# EAGLE design 8x8-LED-Matrix-Rev4 (EAGLE 5.11)
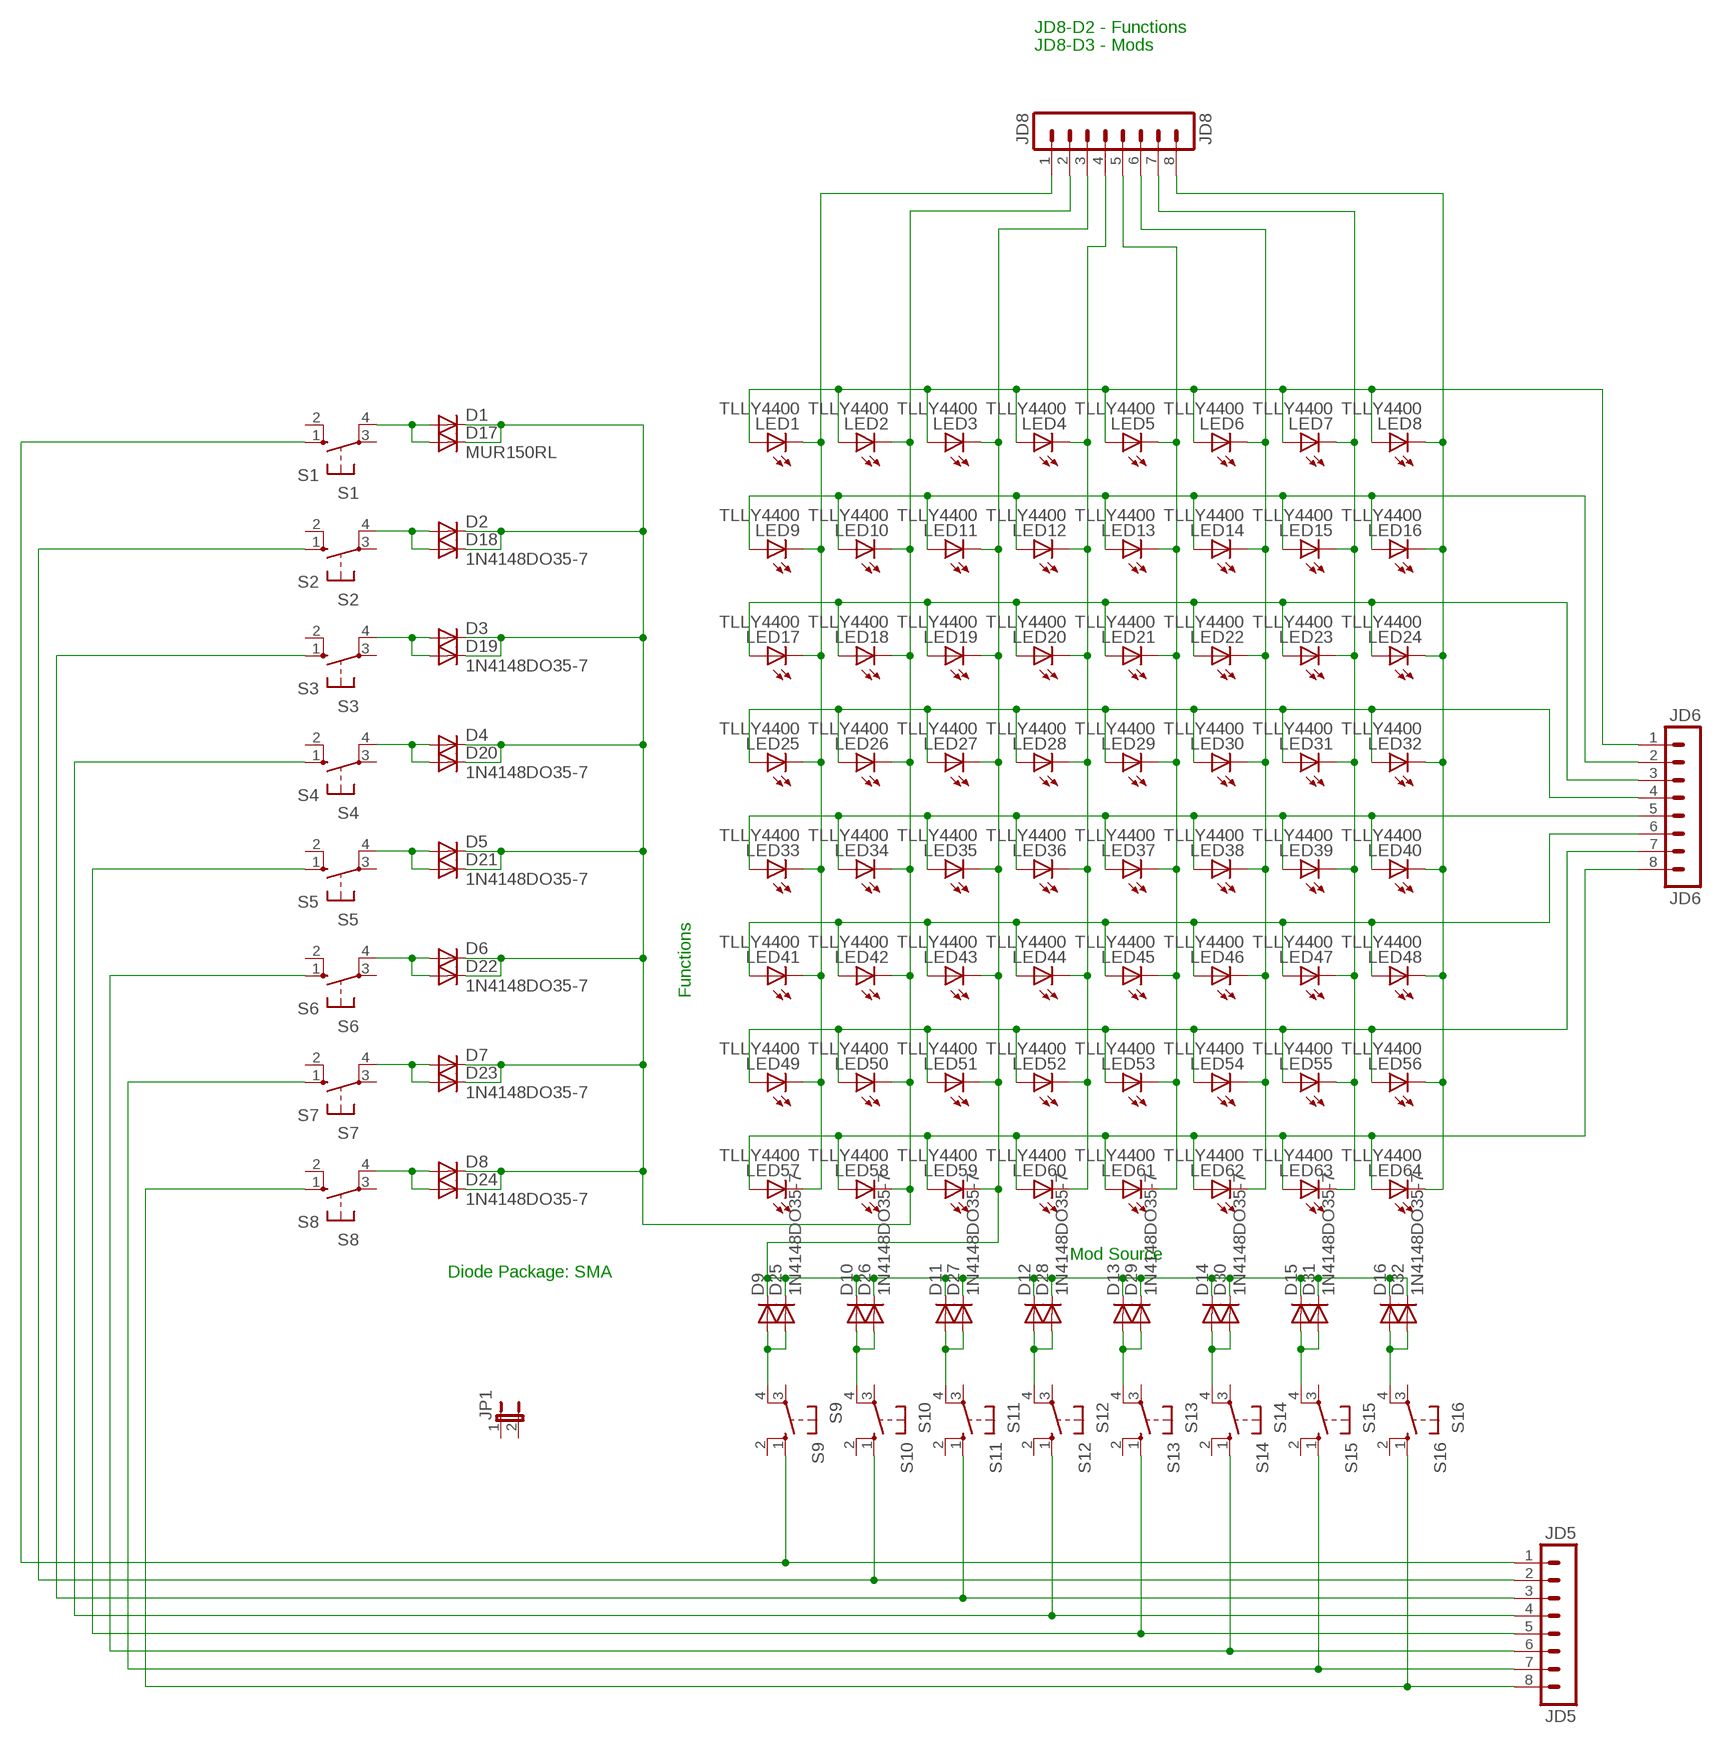
[diagram p0: schematic, sheet 1]

## Parts
D1  DIODE-DO214AC  [DO214AC]
D2  DIODE-DO214AC  [DO214AC]
D3  DIODE-DO214AC  [DO214AC]
D4  DIODE-DO214AC  [DO214AC]
D5  DIODE-DO214AC  [DO214AC]
D6  DIODE-DO214AC  [DO214AC]
D7  DIODE-DO214AC  [DO214AC]
D8  DIODE-DO214AC  [DO214AC]
D9  DIODE-DO214AC  [DO214AC]
D10  DIODE-DO214AC  [DO214AC]
D11  DIODE-DO214AC  [DO214AC]
D12  DIODE-DO214AC  [DO214AC]
D13  DIODE-DO214AC  [DO214AC]
D14  DIODE-DO214AC  [DO214AC]
D15  DIODE-DO214AC  [DO214AC]
D16  DIODE-DO214AC  [DO214AC]
D17  MUR150RL  DIODE-D-7.5  [D-7.5]
D18  1N4148DO35-7  DIODE-D-7.5  [D-7.5]
D19  1N4148DO35-7  DIODE-D-7.5  [D-7.5]
D20  1N4148DO35-7  DIODE-D-7.5  [D-7.5]
D21  1N4148DO35-7  DIODE-D-7.5  [D-7.5]
D22  1N4148DO35-7  DIODE-D-7.5  [D-7.5]
D23  1N4148DO35-7  DIODE-D-7.5  [D-7.5]
D24  1N4148DO35-7  DIODE-D-7.5  [D-7.5]
D25  1N4148DO35-7  DIODE-D-7.5  [D-7.5]
D26  1N4148DO35-7  DIODE-D-7.5  [D-7.5]
D27  1N4148DO35-7  DIODE-D-7.5  [D-7.5]
D28  1N4148DO35-7  DIODE-D-7.5  [D-7.5]
D29  1N4148DO35-7  DIODE-D-7.5  [D-7.5]
D30  1N4148DO35-7  DIODE-D-7.5  [D-7.5]
D31  1N4148DO35-7  DIODE-D-7.5  [D-7.5]
D32  1N4148DO35-7  DIODE-D-7.5  [D-7.5]
JD5  JD5  MA08-1  [MA08-1]
JD6  JD6  MA08-1  [MA08-1]
JD8  JD8  MA08-1  [MA08-1]
JP1  JP1E  [JP1]
LED1  TLLY4400  [LED3MM]
LED2  TLLY4400  [LED3MM]
LED3  TLLY4400  [LED3MM]
LED4  TLLY4400  [LED3MM]
LED5  TLLY4400  [LED3MM]
LED6  TLLY4400  [LED3MM]
LED7  TLLY4400  [LED3MM]
LED8  TLLY4400  [LED3MM]
LED9  TLLY4400  [LED3MM]
LED10  TLLY4400  [LED3MM]
LED11  TLLY4400  [LED3MM]
LED12  TLLY4400  [LED3MM]
LED13  TLLY4400  [LED3MM]
LED14  TLLY4400  [LED3MM]
LED15  TLLY4400  [LED3MM]
LED16  TLLY4400  [LED3MM]
LED17  TLLY4400  [LED3MM]
LED18  TLLY4400  [LED3MM]
LED19  TLLY4400  [LED3MM]
LED20  TLLY4400  [LED3MM]
LED21  TLLY4400  [LED3MM]
LED22  TLLY4400  [LED3MM]
LED23  TLLY4400  [LED3MM]
LED24  TLLY4400  [LED3MM]
LED25  TLLY4400  [LED3MM]
LED26  TLLY4400  [LED3MM]
LED27  TLLY4400  [LED3MM]
LED28  TLLY4400  [LED3MM]
LED29  TLLY4400  [LED3MM]
LED30  TLLY4400  [LED3MM]
LED31  TLLY4400  [LED3MM]
LED32  TLLY4400  [LED3MM]
LED33  TLLY4400  [LED3MM]
LED34  TLLY4400  [LED3MM]
LED35  TLLY4400  [LED3MM]
LED36  TLLY4400  [LED3MM]
LED37  TLLY4400  [LED3MM]
LED38  TLLY4400  [LED3MM]
LED39  TLLY4400  [LED3MM]
LED40  TLLY4400  [LED3MM]
LED41  TLLY4400  [LED3MM]
LED42  TLLY4400  [LED3MM]
LED43  TLLY4400  [LED3MM]
LED44  TLLY4400  [LED3MM]
LED45  TLLY4400  [LED3MM]
LED46  TLLY4400  [LED3MM]
LED47  TLLY4400  [LED3MM]
LED48  TLLY4400  [LED3MM]
LED49  TLLY4400  [LED3MM]
LED50  TLLY4400  [LED3MM]
LED51  TLLY4400  [LED3MM]
LED52  TLLY4400  [LED3MM]
LED53  TLLY4400  [LED3MM]
LED54  TLLY4400  [LED3MM]
LED55  TLLY4400  [LED3MM]
LED56  TLLY4400  [LED3MM]
LED57  TLLY4400  [LED3MM]
LED58  TLLY4400  [LED3MM]
LED59  TLLY4400  [LED3MM]
LED60  TLLY4400  [LED3MM]
LED61  TLLY4400  [LED3MM]
LED62  TLLY4400  [LED3MM]
LED63  TLLY4400  [LED3MM]
LED64  TLLY4400  [LED3MM]
S1  S1  10-XX  [B3F-10XX]
S2  S2  10-XX  [B3F-10XX]
S3  S3  10-XX  [B3F-10XX]
S4  S4  10-XX  [B3F-10XX]
S5  S5  10-XX  [B3F-10XX]
S6  S6  10-XX  [B3F-10XX]
S7  S7  10-XX  [B3F-10XX]
S8  S8  10-XX  [B3F-10XX]
S9  S9  10-XX  [B3F-10XX]
S10  S10  10-XX  [B3F-10XX]
S11  S11  10-XX  [B3F-10XX]
S12  S12  10-XX  [B3F-10XX]
S13  S13  10-XX  [B3F-10XX]
S14  S14  10-XX  [B3F-10XX]
S15  S15  10-XX  [B3F-10XX]
S16  S16  10-XX  [B3F-10XX]

## Nets
N$1: JD6.1 LED1.A LED2.A LED3.A LED4.A LED5.A LED6.A LED7.A LED8.A
N$2: JD6.2 LED9.A LED10.A LED11.A LED12.A LED13.A LED14.A LED15.A LED16.A
N$3: JD6.3 LED17.A LED18.A LED19.A LED20.A LED21.A LED22.A LED23.A LED24.A
N$4: JD6.4 LED25.A LED26.A LED27.A LED28.A LED29.A LED30.A LED31.A LED32.A
N$5: JD6.5 LED33.A LED34.A LED35.A LED36.A LED37.A LED38.A LED39.A LED40.A
N$6: JD6.6 LED41.A LED42.A LED43.A LED44.A LED45.A LED46.A LED47.A LED48.A
N$7: D1.A D17.A S1.4(P1)
N$8: JD6.8 LED57.A LED58.A LED59.A LED60.A LED61.A LED62.A LED63.A LED64.A
N$9: JD8.1 LED1.K(C) LED9.K(C) LED17.K(C) LED25.K(C) LED33.K(C) LED41.K(C) LED49.K(C) LED57.K(C)
N$10: D1.C D2.C D3.C D4.C D5.C D6.C D7.C D8.C D17.C D18.C D19.C D20.C D21.C D22.C D23.C D24.C JD8.2 LED2.K(C) LED10.K(C) LED18.K(C) LED26.K(C) LED34.K(C) LED42.K(C) LED50.K(C) LED58.K(C)
N$11: D2.A D18.A S2.4(P1)
N$12: JD8.4 LED4.K(C) LED12.K(C) LED20.K(C) LED28.K(C) LED36.K(C) LED44.K(C) LED52.K(C) LED60.K(C)
N$13: JD8.5 LED5.K(C) LED13.K(C) LED21.K(C) LED29.K(C) LED37.K(C) LED45.K(C) LED53.K(C) LED61.K(C)
N$14: JD8.6 LED6.K(C) LED14.K(C) LED22.K(C) LED30.K(C) LED38.K(C) LED46.K(C) LED54.K(C) LED62.K(C)
N$15: JD8.7 LED7.K(C) LED15.K(C) LED23.K(C) LED31.K(C) LED39.K(C) LED47.K(C) LED55.K(C) LED63.K(C)
N$16: JD8.8 LED8.K(C) LED16.K(C) LED24.K(C) LED32.K(C) LED40.K(C) LED48.K(C) LED56.K(C) LED64.K(C)
N$17: JD6.7 LED49.A LED50.A LED51.A LED52.A LED53.A LED54.A LED55.A LED56.A
N$18: JD5.1 S1.1(S) S9.1(S)
N$19: JD5.2 S2.1(S) S10.1(S)
N$20: JD5.4 S4.1(S) S12.1(S)
N$21: JD5.5 S5.1(S) S13.1(S)
N$22: JD5.6 S6.1(S) S14.1(S)
N$23: JD5.7 S7.1(S) S15.1(S)
N$24: JD5.8 S8.1(S) S16.1(S)
N$25: JD5.3 S3.1(S) S11.1(S)
N$26: D3.A D19.A S3.4(P1)
N$27: D4.A D20.A S4.4(P1)
N$28: D5.A D21.A S5.4(P1)
N$29: D6.A D22.A S6.4(P1)
N$30: D7.A D23.A S7.4(P1)
N$31: D9.C D10.C D11.C D12.C D13.C D14.C D15.C D16.C D25.C D26.C D27.C D28.C D29.C D30.C D31.C D32.C JD8.3 LED3.K(C) LED11.K(C) LED19.K(C) LED27.K(C) LED35.K(C) LED43.K(C) LED51.K(C) LED59.K(C)
N$32: D9.A D25.A S9.4(P1)
N$33: D10.A D26.A S10.4(P1)
N$34: D8.A D24.A S8.4(P1)
N$35: D11.A D27.A S11.4(P1)
N$36: D12.A D28.A S12.4(P1)
N$37: D13.A D29.A S13.4(P1)
N$38: D14.A D30.A S14.4(P1)
N$39: D15.A D31.A S15.4(P1)
N$40: D16.A D32.A S16.4(P1)
Unconnected: JP1.1 JP1.2 S1.2(S1) S1.3(P) S2.2(S1) S2.3(P) S3.2(S1) S3.3(P) S4.2(S1) S4.3(P) S5.2(S1) S5.3(P) S6.2(S1) S6.3(P) S7.2(S1) S7.3(P) S8.2(S1) S8.3(P) S9.2(S1) S9.3(P) S10.2(S1) S10.3(P) S11.2(S1) S11.3(P) S12.2(S1) S12.3(P) S13.2(S1) S13.3(P) S14.2(S1) S14.3(P) S15.2(S1) S15.3(P) S16.2(S1) S16.3(P)

## Notes on the sheet
- JD8-D2 - Functions
- JD8-D3 - Mods
- Functions
- Mod Source
- Diode Package: SMA

## Library data of the parts
D1-D16 = diode:DIODE-: DIODE
D17-D32 = diodes:DIODE-: DIODE
JD5 JD6 JD8 = con-lstb:MA08-1: PIN HEADER; OC_FARNELL: unknown; OC_NEWARK: unknown
JP1 = jumper:JP1E: JUMPER
LED1-LED64 = led:TLLY4400: Low Current (2mA) LED 3 mm Tinted Diffused Package color YELLOW Source: Data sheet <http://www.farnell.com/datasheets/391098.pdf>; MF: VISHAY SEMICONDUCTOR; OC_FARNELL: 1612439
S1-S16 = switch-omron:10-XX: OMRON SWITCH; MPN: B3F-1000; OC_FARNELL: 176432; OC_NEWARK: 36M3542

## Board
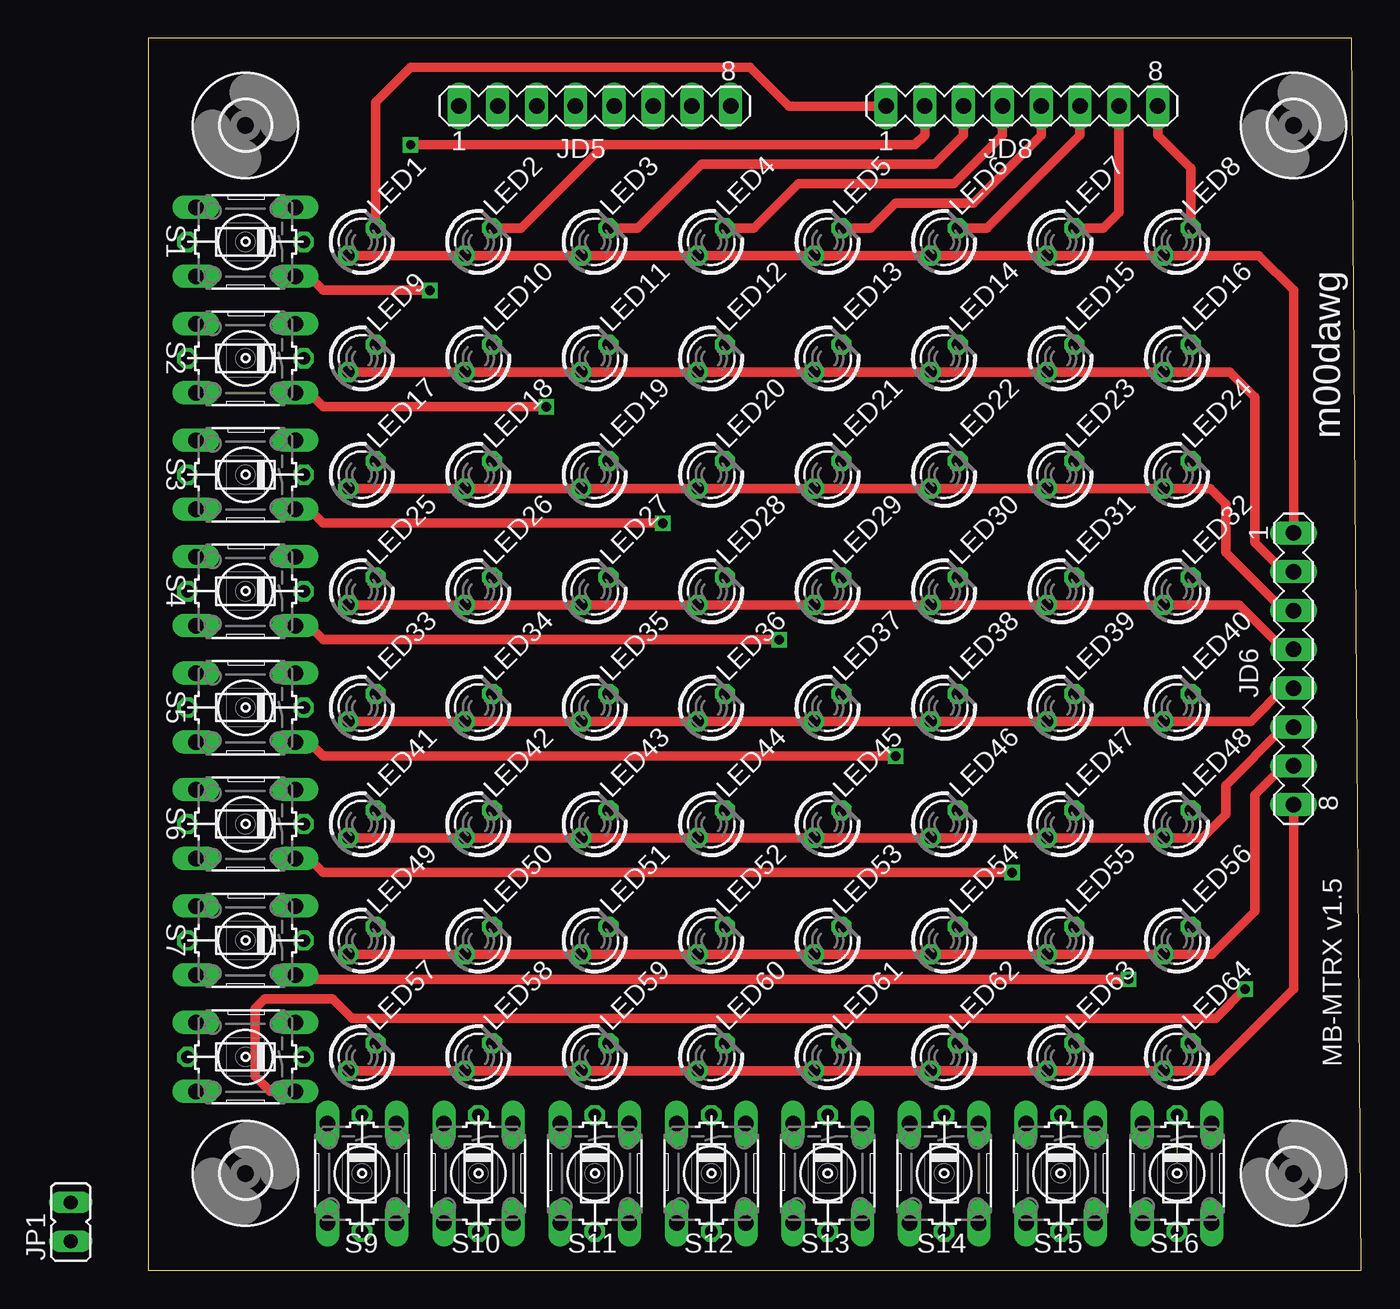
[diagram p1: board, top side]
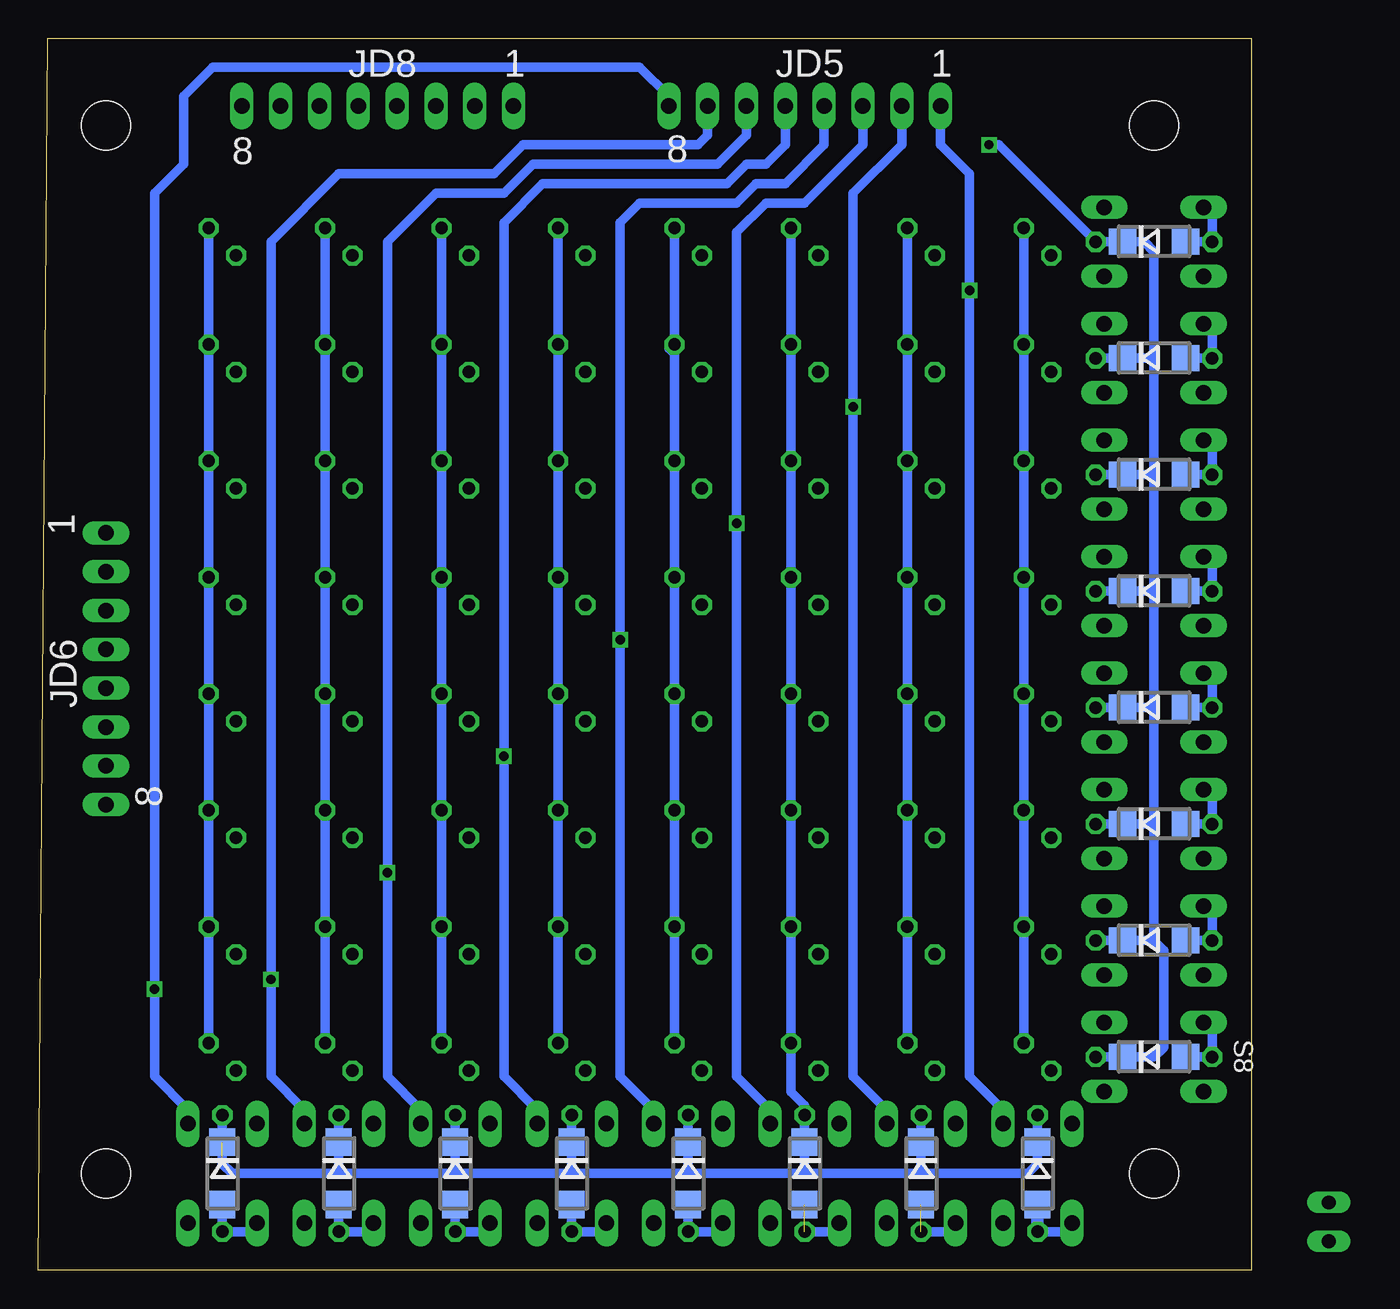
[diagram p2: board, bottom side, seen from below]

Size 79.36 x 80.64 mm. Coordinates in mm from the lower left corner, seen from the top.
Outline: 0,0 79.36,0 78.73,80.64 0,80.64 0,0
Copper layers (1*16): Top 0.035mm / dielectric 1.5mm / Bottom 0.035mm
Design rules "batchpcb": minimum track width 8mil, minimum drill 20mil, track to track 8mil, track to pad 8mil, pad to pad 8mil, via to via 8mil, smd to smd 8mil, copper to edge 40mil, drill to drill 8mil, minimum pad ring 10mil, minimum via ring 8mil, stop-mask expansion 4mil, vias tented up to drill 0mil, thermal gap 10mil

### Footprints (pad centres in the part's own frame; a part is rotated, then mirrored left to right if it is on the bottom)
DO214AC = smd 1.8 x 1.7: A 2.05,0; C -2.05,0
D-7.5 = drill 0.813 octagon: A 3.81,0; C -3.81,0
MA08-1 = drill 1.016 long: 1 -8.89,0; 2 -6.35,0; 3 -3.81,0; 4 -1.27,0; 5 1.27,0; 6 3.81,0; 7 6.35,0; 8 8.89,0
JP1 = drill 0.914 long: 1 0,-1.27; 2 0,1.27
LED3MM = drill 0.813 octagon: A -1.27,0; K 1.27,0
B3F-10XX = drill 1.016 long: 1 -3.251,2.261; 2 3.251,2.261; 3 -3.251,-2.261; 4 3.251,-2.261
3,2 = hole 3.2: 0,0

### Placement (x,y rotation side)
D1  6.35,67.31 0 bottom
D2  6.35,59.69 0 bottom
D3  6.35,52.07 0 bottom
D4  6.35,44.45 0 bottom
D5  6.35,36.83 0 bottom
D6  6.35,29.21 0 bottom
D7  6.35,21.59 0 bottom
D8  6.35,13.97 0 bottom
D9  13.97,6.35 270 bottom
D10  21.59,6.35 270 bottom
D11  29.21,6.35 270 bottom
D12  36.83,6.35 270 bottom
D13  44.45,6.35 270 bottom
D14  52.07,6.35 270 bottom
D15  59.69,6.35 270 bottom
D16  67.31,6.35 270 bottom
D17  6.35,67.31 180 top
D18  6.35,59.69 180 top
D19  6.35,52.07 180 top
D20  6.35,44.45 180 top
D21  6.35,36.83 180 top
D22  6.35,29.21 180 top
D23  6.35,21.59 180 top
D24  6.35,13.97 180 top
D25  13.97,6.35 270 top
D26  21.59,6.35 270 top
D27  29.21,6.35 270 top
D28  36.83,6.35 270 top
D29  44.45,6.35 270 top
D30  52.07,6.35 270 top
D31  59.69,6.35 270 top
D32  67.31,6.35 270 top
JD5  29.21,76.2 0 top
JD6  74.93,39.37 270 top
JD8  57.15,76.2 0 top
JP1  -5.08,3.17 0 top  (outside the outline)
LED1  13.97,67.31 45 top
LED2  21.59,67.31 45 top
LED3  29.21,67.31 45 top
LED4  36.83,67.31 45 top
LED5  44.45,67.31 45 top
LED6  52.07,67.31 45 top
LED7  59.69,67.31 45 top
LED8  67.31,67.31 45 top
LED9  13.97,59.69 45 top
LED10  21.59,59.69 45 top
LED11  29.21,59.69 45 top
LED12  36.83,59.69 45 top
LED13  44.45,59.69 45 top
LED14  52.07,59.69 45 top
LED15  59.69,59.69 45 top
LED16  67.31,59.69 45 top
LED17  13.97,52.07 45 top
LED18  21.59,52.07 45 top
LED19  29.21,52.07 45 top
LED20  36.83,52.07 45 top
LED21  44.45,52.07 45 top
LED22  52.07,52.07 45 top
LED23  59.69,52.07 45 top
LED24  67.31,52.07 45 top
LED25  13.97,44.45 45 top
LED26  21.59,44.45 45 top
LED27  29.21,44.45 45 top
LED28  36.83,44.45 45 top
LED29  44.45,44.45 45 top
LED30  52.07,44.45 45 top
LED31  59.69,44.45 45 top
LED32  67.31,44.45 45 top
LED33  13.97,36.83 45 top
LED34  21.59,36.83 45 top
LED35  29.21,36.83 45 top
LED36  36.83,36.83 45 top
LED37  44.45,36.83 45 top
LED38  52.07,36.83 45 top
LED39  59.69,36.83 45 top
LED40  67.31,36.83 45 top
LED41  13.97,29.21 45 top
LED42  21.59,29.21 45 top
LED43  29.21,29.21 45 top
LED44  36.83,29.21 45 top
LED45  44.45,29.21 45 top
LED46  52.07,29.21 45 top
LED47  59.69,29.21 45 top
LED48  67.31,29.21 45 top
LED49  13.97,21.59 45 top
LED50  21.59,21.59 45 top
LED51  29.21,21.59 45 top
LED52  36.83,21.59 45 top
LED53  44.45,21.59 45 top
LED54  52.07,21.59 45 top
LED55  59.69,21.59 45 top
LED56  67.31,21.59 45 top
LED57  13.97,13.97 45 top
LED58  21.59,13.97 45 top
LED59  29.21,13.97 45 top
LED60  36.83,13.97 45 top
LED61  44.45,13.97 45 top
LED62  52.07,13.97 45 top
LED63  59.69,13.97 45 top
LED64  67.31,13.97 45 top
S1  6.35,67.31 180 top
S2  6.35,59.69 180 top
S3  6.35,52.07 180 top
S4  6.35,44.45 180 top
S5  6.35,36.83 180 top
S6  6.35,29.21 180 top
S7  6.35,21.59 180 top
S8  6.35,13.97 180 top
S9  13.97,6.35 270 top
S10  21.59,6.35 270 top
S11  29.21,6.35 270 top
S12  36.83,6.35 270 top
S13  44.45,6.35 270 top
S14  52.07,6.35 270 top
S15  59.69,6.35 270 top
S16  67.31,6.35 270 top
U$1  [3,2]  6.35,74.93 0 top
U$2  [3,2]  74.93,74.93 0 top
U$3  [3,2]  74.93,6.35 0 top
U$4  [3,2]  6.35,6.35 0 top

### Tracks (layer width: path | path; a pad name or v marks a point on that pad's centre or on a via)
N$1
  Top 0.61: JD6.1 74.93,64.14 72.65,66.41 LED8.A LED7.A LED6.A LED5.A LED4.A LED3.A LED2.A LED1.A
N$2
  Top 0.61: JD6.2 74.3,45.72 72.39,47.62 72.39,57.15 70.75,58.79 LED16.A LED15.A LED14.A LED13.A LED12.A LED11.A LED10.A LED9.A
N$3
  Top 0.61: JD6.3 74.3,43.18 70.48,46.99 70.48,50.16 69.48,51.17 LED24.A LED23.A LED22.A LED21.A LED20.A LED19.A LED18.A LED17.A
N$4
  Top 0.61: JD6.4 74.3,40.64 71.38,43.55 LED32.A LED31.A LED30.A LED29.A LED28.A LED27.A LED26.A LED25.A
N$5
  Top 0.61: JD6.5 74.3,38.1 72.13,35.93 LED40.A LED39.A LED38.A LED37.A LED36.A LED35.A LED34.A LED33.A
N$6
  Top 0.61: JD6.6 74.3,35.56 70.48,31.75 70.48,29.84 68.95,28.31 LED48.A LED47.A LED46.A LED45.A LED44.A LED43.A LED42.A LED41.A
N$7
  Bottom 0.61: D1.A D17.A 2.54,69.01 S1.4
N$8
  Top 0.61: JD6.8 74.93,18.41 69.59,13.07 LED64.A LED63.A LED62.A LED61.A LED60.A LED59.A LED58.A LED57.A
N$9
  Top 0.61: LED1.K 14.87,76.46 17.14,78.74 39.37,78.74 41.91,76.2 JD8.1
  Bottom 0.61: LED1.K LED9.K LED17.K LED25.K LED33.K LED41.K LED49.K LED57.K
N$10  (via drill 0.6)
  Top 0.61: LED2.K 24.39,68.21 29.84,73.66 | 29.84,73.66 50.16,73.66 50.8,74.3 JD8.2 | v17.14,73.66 29.84,73.66
  Bottom 0.61: LED2.K LED10.K LED18.K LED26.K LED34.K LED42.K LED50.K LED58.K | v17.14,73.66 16.51,73.66 D17.C | D24.C D8.C 6.35,13.97 5.71,14.61 5.71,20.95 6.35,21.59 | D23.C D7.C 6.35,21.59 | D6.C D22.C 6.35,29.21 | D5.C D21.C 6.35,36.83 | D4.C D20.C 6.35,44.45 | D3.C D19.C 6.35,52.07 | D18.C D2.C 6.35,59.69 | D17.C D1.C | D17.C 6.99,67.31 6.35,66.67 6.35,59.69 | 6.35,21.59 6.35,29.21 | 6.35,29.21 6.35,36.83 | 6.35,36.83 6.35,44.45 | 6.35,44.45 6.35,52.07 | 6.35,52.07 6.35,59.69
N$11
  Bottom 0.61: D2.A D18.A 2.54,61.39 S2.4
N$12
  Top 0.61: JD8.4 55.88,74.3 52.7,71.12 42.55,71.12 39.63,68.21 LED4.K
  Bottom 0.61: LED4.K LED12.K 37.99,60.33 38.1,60.33 37.73,59.95 LED20.K LED28.K LED36.K LED44.K LED52.K LED60.K
N$13
  Top 0.61: JD8.5 58.42,74.3 53.98,69.85 48.9,69.85 47.25,68.21 LED5.K
  Bottom 0.61: LED5.K LED13.K LED21.K LED29.K LED37.K LED45.K LED53.K LED61.K
N$14
  Top 0.61: LED6.K 54.87,68.21 60.96,74.3 JD8.6
  Bottom 0.61: LED6.K LED14.K LED22.K LED30.K LED38.K LED46.K LED54.K LED62.K
N$15
  Top 0.61: LED7.K 62.49,68.21 63.5,69.22 JD8.7
  Bottom 0.61: LED7.K LED15.K LED23.K LED31.K LED39.K LED47.K LED55.K LED63.K
N$16
  Top 0.61: JD8.8 66.04,74.3 68.21,72.13 LED8.K
  Bottom 0.61: LED8.K LED16.K LED24.K LED32.K LED40.K LED48.K LED56.K LED64.K
N$17
  Top 0.61: JD6.7 74.3,33.02 72.39,31.11 72.39,23.5 69.59,20.69 LED56.A LED55.A LED54.A LED53.A LED52.A LED51.A LED50.A LED49.A
N$18  (via drill 0.6)
  Top 0.61: S1.1 10.52,65.05 11.43,64.14 v18.41,64.14
  Bottom 0.61: S9.1 16.23,10.52 18.41,12.7 v18.41,64.14 18.41,71.75 20.32,73.66 JD5.1
N$19  (via drill 0.6)
  Top 0.61: S2.1 10.52,57.43 11.43,56.52 v26.04,56.52
  Bottom 0.61: S10.1 23.85,10.52 26.04,12.7 v26.04,56.52 26.04,70.48 22.86,73.66 JD5.2
N$20  (via drill 0.6)
  Top 0.61: S4.1 10.52,42.19 11.43,41.27 v41.27,41.27
  Bottom 0.61: S12.1 39.09,10.52 41.27,12.7 v41.27,41.27 41.27,68.58 40.01,69.85 33.66,69.85 32.38,71.12 30.48,71.12 27.94,73.66 JD5.4
N$21  (via drill 0.6)
  Top 0.61: S5.1 10.52,34.57 11.43,33.66 v48.9,33.66
  Bottom 0.61: S13.1 46.71,10.52 48.9,12.7 v48.9,33.66 48.9,68.58 46.35,71.12 34.29,71.12 33.02,72.39 31.75,72.39 30.48,73.66 JD5.5
N$22  (via drill 0.6)
  Top 0.61: S6.1 10.52,26.95 11.43,26.04 v56.52,26.04
  Bottom 0.61: S14.1 54.33,10.52 56.52,12.7 v56.52,26.04 56.52,67.31 53.34,70.48 48.9,70.48 46.99,72.39 34.92,72.39 33.02,74.3 JD5.6
N$23  (via drill 0.6)
  Top 0.61: S7.1 10.52,19.33 10.79,19.05 v64.14,19.05
  Bottom 0.61: S15.1 61.95,10.52 64.14,12.7 v64.14,19.05 64.14,67.31 59.69,71.75 49.53,71.75 47.62,73.66 36.2,73.66 35.56,74.3 JD5.7
N$24  (via drill 0.6)
  Top 0.61: v71.75,18.41 69.85,16.51 13.34,16.51 12.06,17.78 7.62,17.78 6.99,17.14 6.99,12.7 7.98,11.71 S8.1
  Bottom 0.61: S16.1 69.57,10.52 71.75,12.7 v71.75,18.41 71.75,70.48 69.85,72.39 69.85,76.83 67.94,78.74 40.01,78.74 38.1,76.83 JD5.8
N$25  (via drill 0.6)
  Top 0.61: S3.1 10.52,49.81 11.43,48.9 v33.66,48.9
  Bottom 0.61: S11.1 31.47,10.52 33.66,12.7 v33.66,48.9 33.66,67.94 31.75,69.85 29.21,69.85 25.4,73.66 JD5.3
N$26
  Bottom 0.61: D3.A D19.A 2.54,53.77 S3.4
N$27
  Bottom 0.61: D4.A D20.A 2.54,46.15 S4.4
N$28
  Bottom 0.61: D5.A D21.A 2.54,38.53 S5.4
N$29
  Bottom 0.61: D6.A D22.A 2.54,30.91 S6.4
N$30
  Bottom 0.61: D7.A D23.A 2.54,23.29 S7.4
N$31  (1 unrouted)
  Top 0.61: LED3.K 32.01,68.21 36.2,72.39 51.44,72.39 53.34,74.3 JD8.3
  Bottom 0.61: LED3.K LED11.K LED19.K LED27.K LED35.K LED43.K LED51.K LED59.K 30.11,11.69 29.21,10.79 D27.C D11.C 29.21,6.35 | D32.C 67.31,6.99 66.67,6.35 59.69,6.35 | 21.59,6.35 14.61,6.35 13.97,6.99 D9.C D25.C | 21.59,6.35 29.21,6.35 | 29.21,6.35 36.83,6.35 | 36.83,6.35 44.45,6.35 | 44.45,6.35 52.07,6.35 | 52.07,6.35 59.69,6.35 | 21.59,6.35 D10.C D26.C | 36.83,6.35 D12.C D28.C | 44.45,6.35 D13.C D29.C | 52.07,6.35 D14.C D30.C | 59.69,6.35 D15.C D31.C
N$32
  Bottom 0.61: D25.A 12.27,2.54 S9.4
  Bottom 0.813: D25.A D9.A
N$33  (1 unrouted)
  Bottom 0.61: D26.A 19.89,2.54 S10.4
N$34
  Bottom 0.61: D8.A D24.A 2.54,15.67 S8.4
N$35  (1 unrouted)
  Bottom 0.61: D27.A 27.51,2.54 S11.4
N$36
  Bottom 0.61: D12.A D28.A 35.13,2.54 S12.4
N$37
  Bottom 0.61: D13.A D29.A 42.75,2.54 S13.4
N$38
  Bottom 0.61: D14.A D30.A 50.37,2.54 S14.4
N$39
  Bottom 0.61: D15.A D31.A 57.99,2.54 S15.4
N$40
  Bottom 0.61: S16.4 65.61,2.54 D32.A D16.A

### Text on the board
tPlace: m00dawg | MB-MTRX v1.5
bPlace: 1 | JD5 | 1 | JD8 | 8 | 8 | 1 | JD6 | 8